# EAGLE design PCB-DISP256x64_v03-17 (EAGLE 7.7.0)

## Sheet 1 of 2
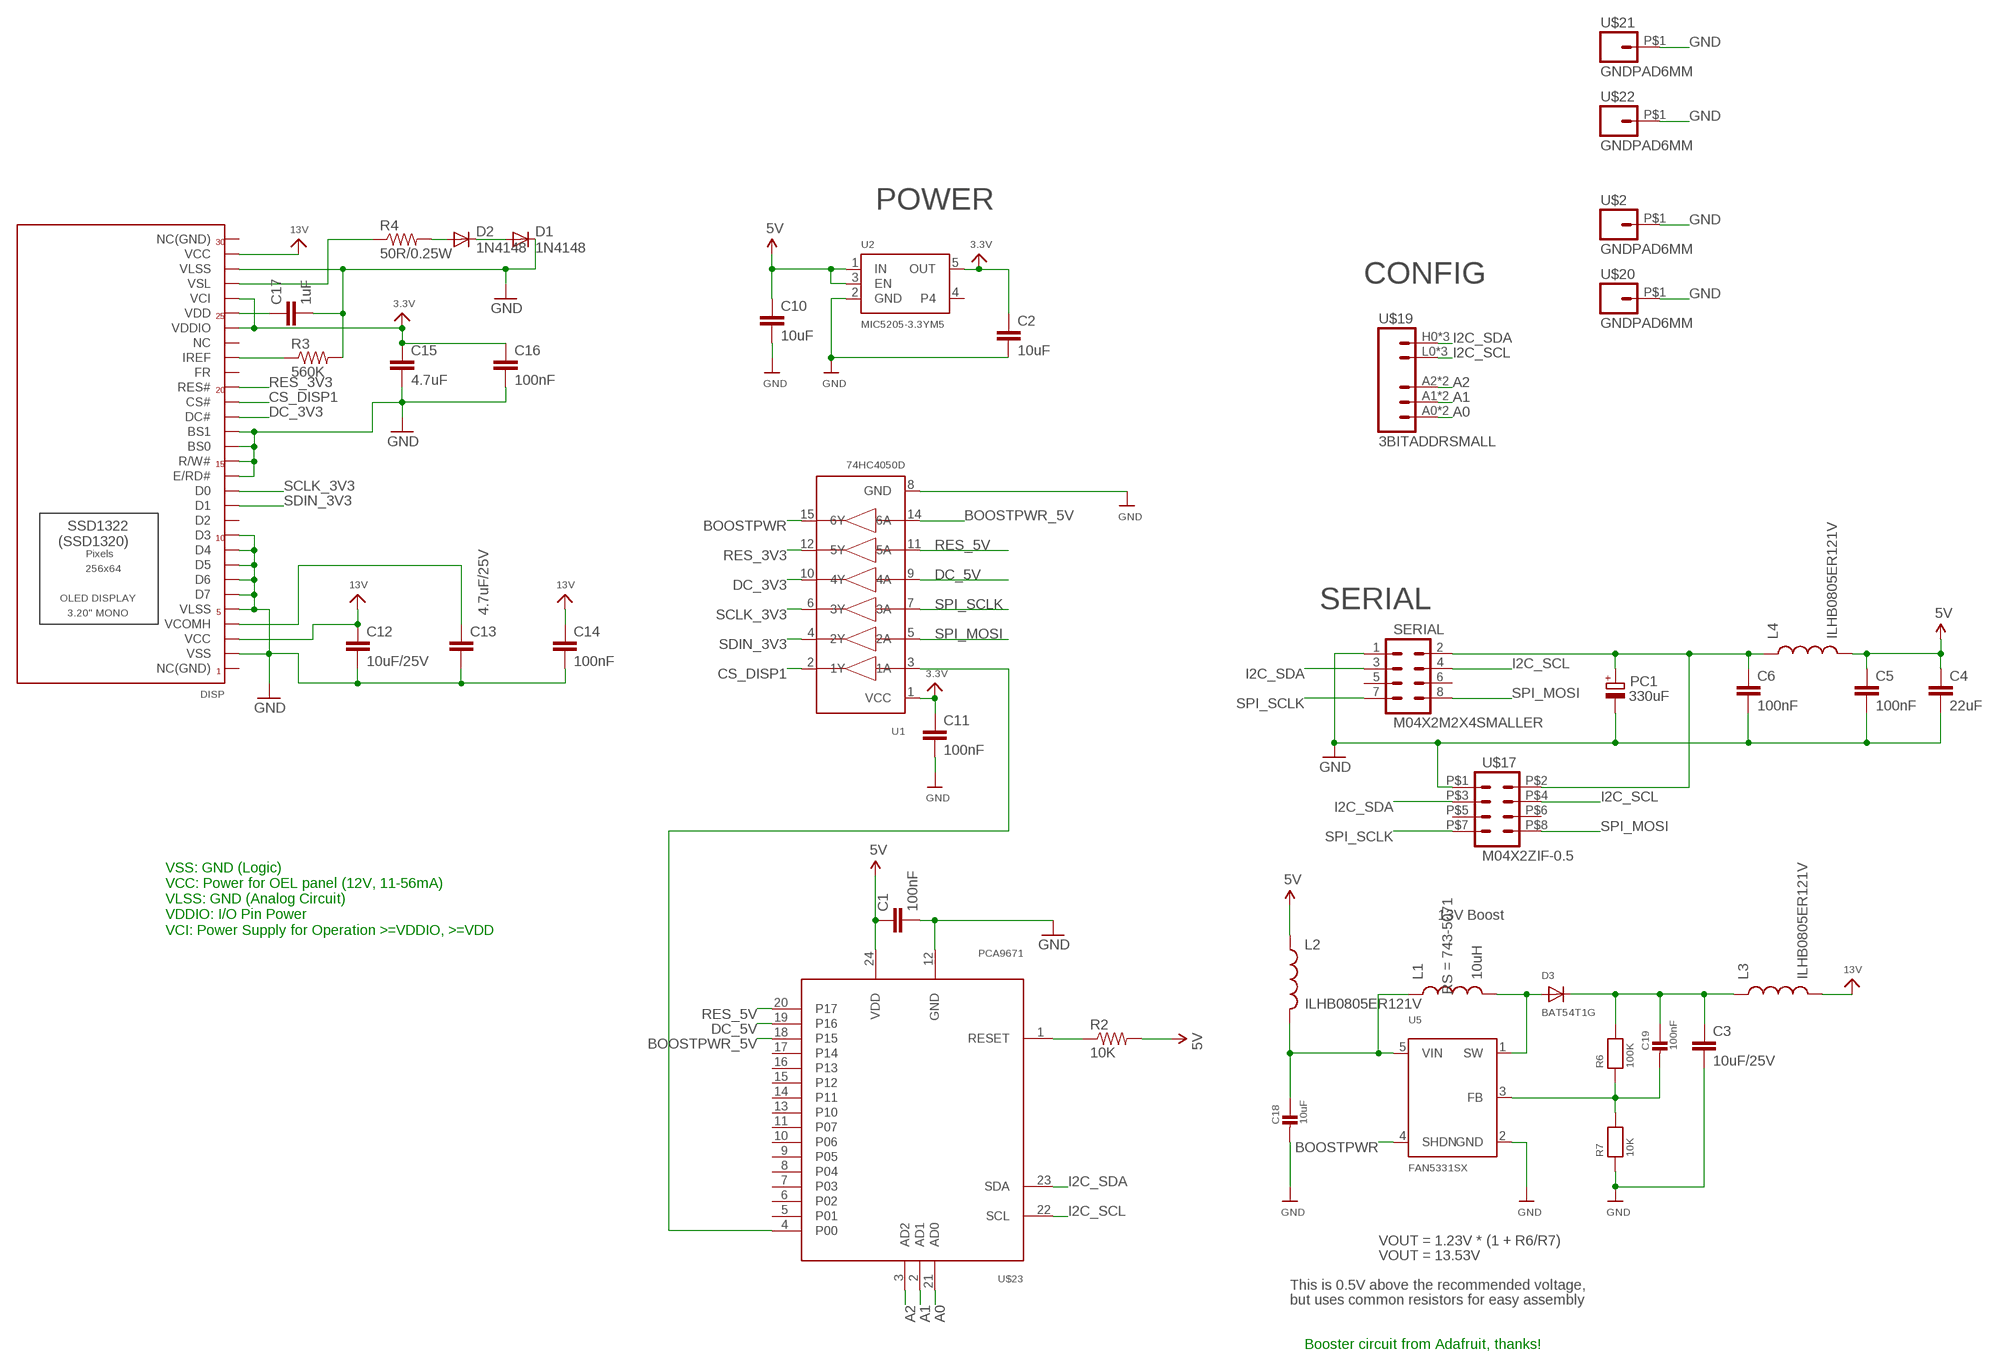
[diagram p0: schematic, sheet 1]

### Parts
C1  100nF  CAP0603-CAP  [0603-CAP]
C2  10uF  CAP0805  [0805]
C3  10uF/25V  CAP0805  [0805]
C4  22uF  CAP0805  [0805]
C5  100nF  CAP0603-CAP  [0603-CAP]
C6  100nF  CAP0603-CAP  [0603-CAP]
C10  10uF  CAP0805  [0805]
C11  100nF  CAP0603-CAP  [0603-CAP]
C12  10uF/25V  CAP0805  [0805]
C13  4.7uF/25V  CAP0805  [0805]
C14  100nF  CAP0603-CAP  [0603-CAP]
C15  4.7uF  CAP0805  [0805]
C16  100nF  CAP0603-CAP  [0603-CAP]
C17  1uF  CAP0603-CAP  [0603-CAP]
C18  10uF  CAP_CERAMIC0805  [0805]
C19  100nF  CAP_CERAMIC0603  [0603]
D1  1N4148  DIODESOD  [SOD-323]
D2  1N4148  DIODESOD  [SOD-323]
D3  BAT54T1G  DIODESOD-123  [SOD-123]
DISP  ER_OLED032-1TOP  [FPC_XF2M-3015-1A]
L1  10uH  POWERINDUCTOR  [3015]
L2  ILHB0805ER121V  INDUCTOR0805  [0805]
L3  ILHB0805ER121V  INDUCTOR0805  [0805]
L4  ILHB0805ER121V  INDUCTOR0805  [0805]
PC1  330uF  CPOL-EUD  [PANASONIC_D]
R2  10K  RESISTOR0603-RES  [0603-RES]
R3  560K  RESISTOR0603-RES  [0603-RES]
R4  50R/0.25W  RESISTOR0603-RES  [0603-RES]
R6  100K  RESISTOR0603  [0603]
R7  10K  RESISTOR0603  [0603]
SERIAL  M04X2M2X4SMALLER  [M2X4SMALLER]
U1  74HC4050D  74HC4050DTSSOP16  [TSSOP16]
U2  MIC5205-3.3YM5  VREG_SOT23-5  [SOT23-5]
U5  FAN5331SX  FAN5331  [SOT23-5@1]
U$2  GNDPAD6MM  [3.2MMPAD6MM]
U$17  M04X2ZIF-0.5  [ZIP-8-0.5]
U$19  3BITADDRSMALL  [3BITADDR_SMALL]
U$20  GNDPAD6MM  [3.2MMPAD6MM]
U$21  GNDPAD6MM  [3.2MMPAD6MM]
U$22  GNDPAD6MM  [3.2MMPAD6MM]
U$23  PCA9671  [TSSOP24]

### Nets
3.3V [Power]: C2.1 C11.1 C15.1 C16.1 DISP.P$5(VCI) DISP.P$7(VDDIO) U1.1(VCC) U2.5(OUT)
5V [Power]: C1.1 C4.1 C5.1 C10.1 L2.1 L4.2 R2.2 U2.1(IN) U2.3(EN) U$23.24(VDD)
13V [Power]: C12.1 C14.1 DISP.P$2(VCC) DISP.P$28(VCC) L3.2
A0: U$19.A0 U$19.AS0(A0) U$23.21(AD0)
A1: U$19.A1 U$19.AS1(A1) U$23.2(AD1)
A2: U$19.A2 U$19.AS2(A2) U$23.3(AD2)
ARD_5V [Power]: C6.1 L4.1 PC1.+ SERIAL.2 U$17.P$2
BOOSTPWR: U1.15(6Y) U5.4(SHDN)
BOOSTPWR_5V [Power]: U1.14(6A) U$23.18(P15)
CS_DISP1: DISP.P$12(CS#) U1.2(1Y)
DC_3V3: DISP.P$13(DC#) U1.10(4Y)
DC_5V: U1.9(4A) U$23.19(P16)
GND [Power]: C1.2 C2.2 C3.2 C4.2 C5.2 C6.2 C10.2 C11.2 C12.2 C13.2 C14.2 C15.2 C16.2 C17.2 C18.2 D1.1(C) DISP.P$3(VLSS) DISP.P$14(BS1) DISP.P$15(BS0) DISP.P$16(R/W#) DISP.P$17(E/RD#) DISP.P$21(D3) DISP.P$22(D4) DISP.P$23(D5) DISP.P$24(D6) DISP.P$25(D7) DISP.P$26(VLSS) DISP.P$29(VSS) PC1.- R3.2 R7.1 SERIAL.1 U1.8(GND) U2.2(GND) U5.2(GND) U$2.P$1 U$17.P$1 U$20.P$1 U$21.P$1 U$22.P$1 U$23.12(GND)
I2C_SCL: SERIAL.4 U$17.P$4 U$19.L0(GND) U$19.L1(GND) U$19.L2(GND) U$23.22(SCL)
I2C_SDA: SERIAL.3 U$17.P$3 U$19.H0(VCC) U$19.H1(VCC) U$19.H2(VCC) U$23.23(SDA)
N$1: R2.1 U$23.1(RESET)
N$2 [Power]: C18.1 L1.1 L2.2 U5.5(VIN)
N$3: U1.3(1A) U$23.4(P00)
N$4: C3.1 C19.1 D3.C L3.1 R6.2
N$5: C13.1 DISP.P$27(VCOMH)
N$6: DISP.P$4(VSL) R4.1
N$10: DISP.P$9(IREF) R3.1
N$11: D2.2(A) R4.2
N$12: C17.1 DISP.P$6(VDD)
N$13: D1.2(A) D2.1(C)
N$14 [BoostPower]: D3.A L1.2 U5.1(SW)
N$15: C19.2 R6.1 R7.2 U5.3(FB)
RES_3V3: DISP.P$11(RES#) U1.12(5Y)
RES_5V: U1.11(5A) U$23.20(P17)
SCLK_3V3: DISP.P$18(D0) U1.6(3Y)
SDIN_3V3: DISP.P$19(D1) U1.4(2Y)
SPI_MOSI: SERIAL.8 U1.5(2A) U$17.P$8
SPI_SCLK: SERIAL.7 U1.7(3A) U$17.P$7
Unconnected: DISP.P$1(NC(GND)) DISP.P$8(NC) DISP.P$10(FR) DISP.P$20(D2) DISP.P$30(NC(GND)) SERIAL.5 SERIAL.6 U2.4 U$17.P$5 U$17.P$6 U$23.5(P01) U$23.6(P02) U$23.7(P03) U$23.8(P04) U$23.9(P05) U$23.10(P06) U$23.11(P07) U$23.13(P10) U$23.14(P11) U$23.15(P12) U$23.16(P13) U$23.17(P14)

### Notes on the sheet
- POWER
- CONFIG
- SERIAL
- 13V Boost
- VSS: GND (Logic)
  VCC: Power for OEL panel (12V, 11-56mA)
  VLSS: GND (Analog Circuit)
  VDDIO: I/O Pin Power
  VCI: Power Supply for Operation >=VDDIO, >=VDD
- VOUT = 1.23V * (1 + R6/R7)
- VOUT = 13.53V
- This is 0.5V above the recommended voltage,
- but uses common resistors for easy assembly
- Booster circuit from Adafruit, thanks!

## Sheet 2 of 2

## Library data of the parts
C1-C6 C10-C17 = SparkFun:CAP: Capacitor Standard 0603 ceramic capacitor, and 0.1" leaded capacitor.
C18 C19 = microbuilder:CAP_CERAMIC: Ceramic Capacitors For new designs, use the packages preceded by an '_' character since they are more reliable: The following footprints should be used on most boards: _0402 - Standard footprint for regular board layouts _0603 - Standard footprint for regular board layouts _0805 - Standard footprint for regular board layouts For extremely tight-pitch boards where space is at a premium, the following 'micro-pitch' footprints can be used (smaller pads, no silkscreen outline, etc.): _0402MP - Micro-pitch footprint for very dense/compact boards _0603MP - Micro-pitch footprint for very dense/compact boards _0805MP - Micro-pitch footprint for very dense/compact boards Commonly Stocked Parts 0402 - 0402 Surface Mount Capacitors 16pF 50V 5% [Digikey: 445-4899-2-ND] 18pF 50V 5% [Digikey: 490-1281-2-ND] 22pF 50V 5% [Digikey: 490-1283-2-ND] 68pF 50V 5% [Digikey: 490-1289-2-ND] 0.1uF 10V 10% [Digikey: 490-1318-2-ND] 1.0uF 6.3V 10% [Digikey: 490-1320-2-ND] 0603 - 0603 Surface Mount Capacitors 16 pF 50V 5% [Digikey: 445-5051-2-ND] 22 pF 50V [Digikey: PCC220ACVTR-ND] 33 pF 50V 5% [Digikey: 490-1415-1-ND] 56pF 50V 5% [Digikey: 490-1421-1-ND] 220pF 50V 5% [Digikey: 445-1285-1-ND] 680 pF 50V 2200 pF 50V 5% C0G [Digikey: 445-1297-1-ND] 5600 pF 100V 5% X7R [Digikey: 478-3711-1-ND] 0.1 µF 25V 10% [Digikey: PCC2277TR-ND] 0.22 µF 16V 10% X7R [Digikey: 445-1318-1-ND] 1.0 µF 25V 10% [Digikey: 445-5146-2-ND] 0603 - RF Specific 3pF 250V +/-0.1pF RF [Digikey: 712-1347-1-ND] 18 pF 250V 5% [Digikey: 478-3505-1-ND or 712-1322-1-ND] 56 pF 250V 5% C0G RF [Digikey: 490-4867-1-ND] 68 pF 250V RF [Digikey: 490-4868-1-ND] 0805 - 0805 Surface Mount Capacitors 220 pF 250V 2% RF Ceramic Capacitor [Digikey: 712-1398-1-ND] 1000 pF 50V 2% NP0 Ceramic Capacitor [Digikey: 478-3760-1-ND] 0.1 µF 25V 10% Ceramic Capacitor [Digikey: PCC1828TR-ND] 1.0 µF 16V 10% Ceramic Capacitor[Digikey: 490-1691-2-ND] 10.0 µF 10V 10% Ceramic Capacitor[Digikey: 709-1228-1-ND] 10.0 uF 16V 10% Ceramic Capacitor [Digikey: 478-5165-2-ND] 47 uF 6.3V 20% Ceramic Capacitor [Digikey: 587-1779-1-ND or 399-5506-1-ND] 1206 - 1206 Surface Mount Capacitors 47uF 10V 20% Ceramic Capacitor [Digikey: 490-5528-1-ND or 399-5508-1-ND or 445-6010-1-ND] 100uF 6.3V -20%, +80% Y5V Ceramic Capacitor (Digikey: 490-4512-1-ND, Mouser: 81-GRM31CF50J107ZE1L)
D1 D2 = SparkFun:DIODE: Diode
D3 = microbuilder:DIODE: Diode
DISP = SKAARHOJ:ER_OLED032-1: 128x128 1.5" RGB OLED - UG-2828GDEDF11 30-Pin 0.5mm Pitch FPC Cable (Top+Bottom Contacts) - OMRON XF2M-3015-1A (Digikey: OR723TR-ND) This FPC connector has contacts on the top and bottom, but the appropriate pin needs to be selected depending on whether the OLED will be inserted right-side up (use the TOP pinout) or upside-down (use the BOTTOM pinout).
L1 = SKAARHOJ:POWERINDUCTOR; RS: 743-5071
L2-L4 = SparkFun:INDUCTOR: Inductors Basic Inductor/Choke - 0603 and 1206. Footprints are not proven and vary greatly between part numbers.
PC1 = rcl:CPOL-EU: POLARIZED CAPACITOR, European symbol
R2-R4 = SparkFun:RESISTOR: Resistor Basic schematic elements and footprints for 0603, 1206, and PTH resistors.
R6 R7 = microbuilder:RESISTOR: Resistors For new designs, use the packages preceded by an '_' character since they are more reliable: The following footprints should be used on most boards: _0402 - Standard footprint for regular board layouts _0603 - Standard footprint for regular board layouts _0805 - Standard footprint for regular board layouts For extremely tight-pitch boards where space is at a premium, the following 'micro-pitch' footprints can be used (smaller pads, no silkscreen outline, etc.): _0402MP - Micro-pitch footprint for very dense/compact boards _0603MP - Micro-pitch footprint for very dense/compact boards _0805MP - Micro-pitch footprint for very dense/compact boards
SERIAL U$17 = SKAARHOJ:M04X2
U1 = SKAARHOJ:74HC4050D: 6-channel level shifter 74HC4050D - 2V-6V Supply Digikey: 74HC4050D,653-ND Mouser: 771-74HC4050D-T
U2 = microbuilder:VREG_SOT23-5: SOT23-5 Fixed Voltage Regulators To better organise some of the SOT23-5 fixed voltage regulators in this library, this new part was created. Part Current Out V Out V In V Dropout Digikey Part No. ADP121 150mA 3.3V 3.4-5.5V 0.09V @ 150mA ADP121-AUJZ33R7CT-ND ADP121 150mA 3.0V 3.1-5.5V 0.09V @ 150mA ADP121-AUJZ30R7CT-ND ADP122 300mA 3.3V 3.4-5.5V 0.085V @ 300mA ADP122AUJZ-3.3-R7CT-ND ADP1712 300mA 3.3V 3.5-5.5V 0.17V @ 300mA ADP1712AUJZ-3.3-R7TR-ND AP7311 (Low Cost) 150mA 3.3V 3.5-6V 0.15V @ 150mA AP7311-33WG-7DICT-ND LD39015M18R 150mA 1.8V 1.9V-5.5V 0.08V @ 100mA 497-6977-1-ND MCP1824T-3302E/OT 300mA 3.3V 3.5V-6V 0.2V @ 300mA MCP1824T-3302E/OTCT-ND MIC5205-2.5YM5 TR 150mA 2.5V 2.7-16V 0.165V @ 150mA 576-1257-2-ND MIC5205-3.0YM5 TR 150mA 3.0V 3.2V-16V 0.165V @ 150mA 576-1258-2-ND MIC5205-3.3YM5 TR 150mA 3.3V 3.5V-16V 0.165V @ 150mA 576-1259-2-ND TPS780330220 150mA 3.3V+2.2V 3.6-5.5V 250mV Max 296-23332-1-ND TDA3663/N1,135 100mA 3.3V 3.5-45V 0.18V @ 50mA 568-5343-1-ND
U5 = microbuilder:FAN5331: FAN5331 - LED/OLED 20V Boost Converter Digikey: FAN5331SXCT-ND
U$2 U$20-U$22 = SKAARHOJ:GNDPAD
U$19 = SKAARHOJ:3BITADDR
U$23 = SKAARHOJ:PCA9671

## Net classes
0 default: width 0.203 mm, drill 0.406 mm, clearance 0.152 mm
1 Power: width 0.305 mm, drill 0.61 mm, clearance 0.203 mm
2 BoostPower: width 0.61 mm, drill 0.61 mm, clearance 0.305 mm

## Board
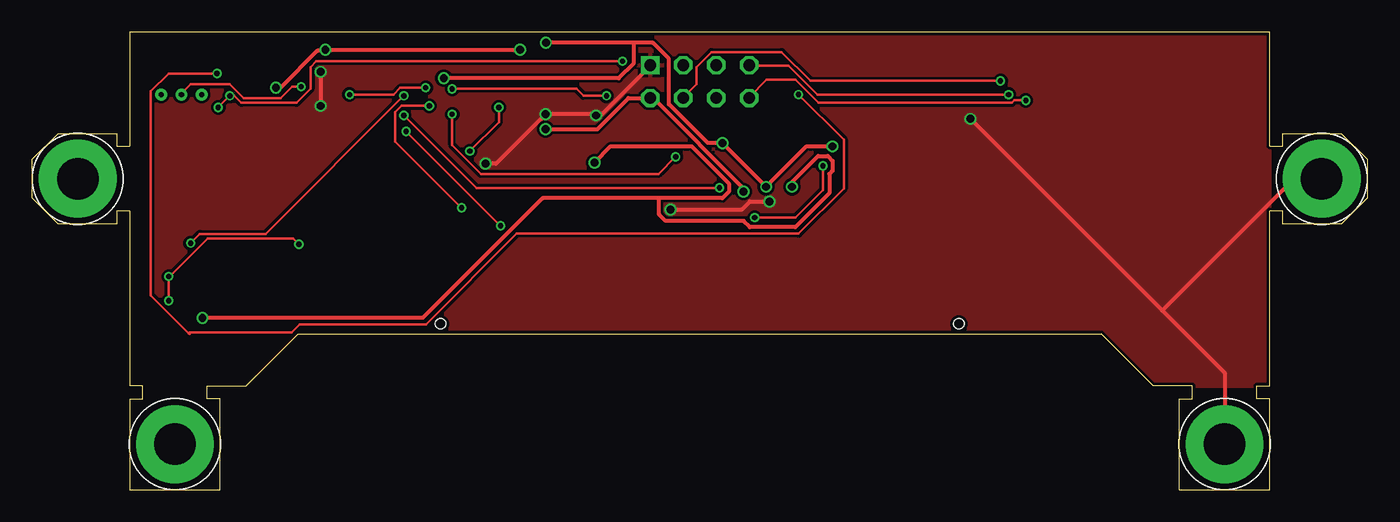
[diagram p1: board, top side]
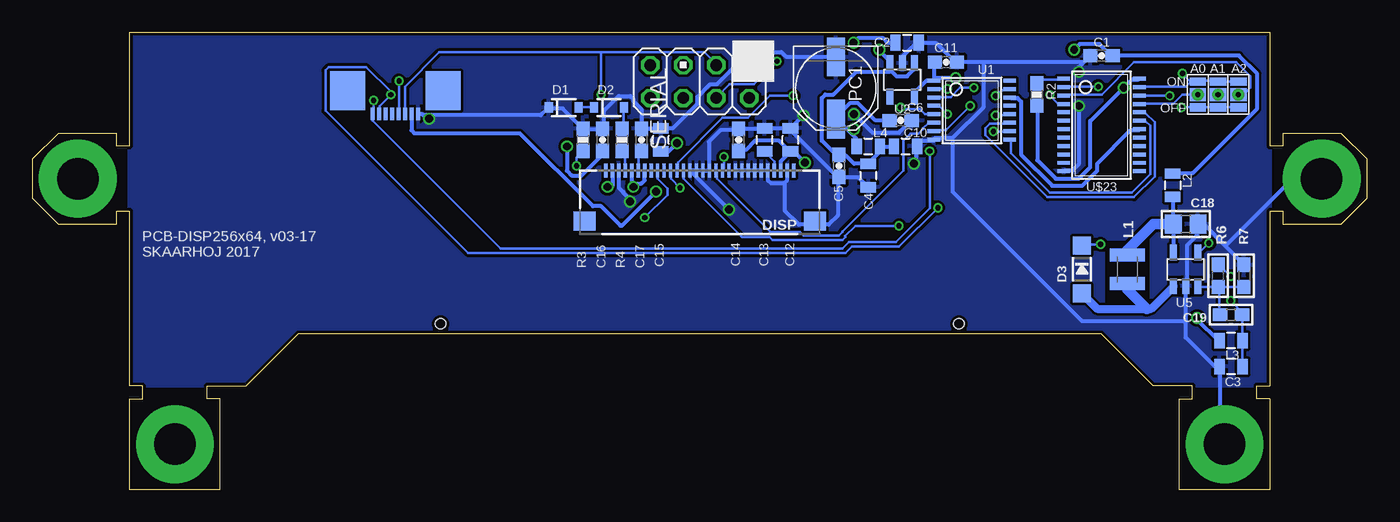
[diagram p2: board, bottom side, seen from below]

Size 103 x 35.3 mm. Coordinates in mm from the lower left corner, seen from the top.
Outline: 95.5,0 95.5,7 94.5,7 94.5,8 95.5,8 95.5,21.5 96.5,21.5 96.5,20.5 101,20.5 103,22.5 103,25.5 101,27.5 96.5,27.5 96.5,26.5 95.5,26.5 95.5,35.3 7.5,35.3 7.5,26.5 6.5,26.5 6.5,27.5 2,27.5 0,25.5 0,22.5 2,20.5 6.5,20.5 6.5,21.5 7.5,21.5 7.5,8 8.5,8 8.5,7 7.5,7 7.5,0 14.5,0 14.5,7 13.5,7 13.5,8 16.5,8 20.5,12 82.5,12 86.5,8 89.5,8 89.5,7 88.5,7 88.5,0 95.5,0
Copper layers (1*16): Top 0.035mm / dielectric 1.5mm / Bottom 0.035mm
Design rules "Fusion_eagle_rule_v1.1": minimum track width 6mil, minimum drill 12mil, track to track 6mil, track to pad 6mil, pad to pad 6mil, via to via 6mil, smd to smd 0mil, copper to edge 10mil, drill to drill 10mil, minimum pad ring 10mil, minimum via ring 6mil, stop-mask expansion 2mil, vias tented up to drill 100mil, thermal gap 10mil
Holes 0.8 mm at 31.5,12.8 71.5,12.8
tRestrict: area 17,14.5 to 20,19
bRestrict: area 17,14.5 to 20,19

### Footprints (pad centres in the part's own frame; a part is rotated, then mirrored left to right if it is on the bottom)
0603-CAP = smd 1.1 x 1: 1 -0.85,0; 2 0.85,0
0805 = smd 0.8 x 1.2: 1 -0.9,0; 2 0.9,0
0805' = smd 1.3 x 1.5: 1 -0.95,0; 2 0.95,0
0603 = smd 1.1 x 1: 1 -0.85,0; 2 0.85,0
SOD-323 = smd 0.63 x 0.83: 1 -1.15,0; 2 1.15,0
SOD-123 = smd 1.4 x 1.4: A 1.85,0; C -1.85,0
FPC_XF2M-3015-1A = smd 0.25 x 1.1: P$1 7.25,-2.63; P$2 6.75,-2.63; P$3 6.25,-2.63; P$4 5.75,-2.63; P$5 5.25,-2.63; P$6 4.75,-2.63; P$7 4.25,-2.63; P$8 3.75,-2.63; P$9 3.25,-2.63; P$10 2.75,-2.63; P$11 2.25,-2.63; P$12 1.75,-2.63; P$13 1.25,-2.63; P$14 0.75,-2.63; P$15 0.25,-2.63; P$16 -0.25,-2.63; P$17 -0.75,-2.63; P$18 -1.25,-2.63; P$19 -1.75,-2.63; P$20 -2.25,-2.63; P$21 -2.75,-2.63; P$22 -3.25,-2.63; P$23 -3.75,-2.63; P$24 -4.25,-2.63; P$25 -4.75,-2.63; P$26 -5.25,-2.63; P$27 -5.75,-2.63; P$28 -6.25,-2.63; P$29 -6.75,-2.63; P$30 -7.25,-2.63 | smd 1.7 x 1.5: SUPPORT1 8.9,1.27; SUPPORT2 -8.9,1.27
3015 = smd 1 x 2.7: 1 -1.1,0; 2 1.1,0
PANASONIC_D = smd 3 x 1.4: + 2.4,0; - -2.4,0
0603-RES = smd 1.1 x 1: 1 -0.85,0; 2 0.85,0
M2X4SMALLER = drill 0.9 square: 1 -1.27,3.81 | drill 0.9 octagon: 2 1.27,3.81; 3 -1.27,1.27; 4 1.27,1.27; 5 -1.27,-1.27; 6 1.27,-1.27; 7 -1.27,-3.81; 8 1.27,-3.81
TSSOP16 = smd 0.305 x 0.991: 1 -3.575,-2.918; 2 -2.925,-2.918; 3 -2.275,-2.918; 4 -1.625,-2.918; 5 -0.975,-2.918; 6 -0.325,-2.918; 7 0.325,-2.918; 8 0.975,-2.918; 9 0.975,2.918; 10 0.325,2.918; 11 -0.325,2.918; 12 -0.975,2.918; 13 -1.625,2.918; 14 -2.275,2.918; 15 -2.925,2.918; 16 -3.575,2.918
SOT23-5 = smd 0.55 x 1.2: 1 -0.95,-1.3; 2 0,-1.3; 3 0.95,-1.3; 4 0.95,1.3; 5 -0.95,1.3
SOT23-5@1 = smd 0.55 x 1.2: 1 -0.95,-1.3; 2 0,-1.3; 3 0.95,-1.3; 4 0.95,1.3; 5 -0.95,1.3
3.2MMPAD6MM = drill 3.2 pad 6: P$1 0,0
ZIP-8-0.5 = smd 2.7 x 3: GND$1 3.68,-1.8; GND$9 -3.68,-1.8 | smd 0.3 x 0.96: P$1 -1.75,0; P$2 -1.25,0; P$3 -0.75,0; P$4 -0.25,0; P$5 0.25,0; P$6 0.75,0; P$7 1.25,0; P$8 1.75,0
3BITADDR_SMALL = drill 0.4: A0 -1.565,0; A1 0,0; A2 1.565,0 | smd 1.27 x 1: AS0 -1.565,0; AS1 0,0; AS2 1.565,0 | smd 1.27 x 0.635: H0 -1.565,1; H1 0,1; H2 1.565,1; L0 -1.565,-1; L1 0,-1; L2 1.565,-1
TSSOP24 = smd 0.305 x 0.991: 1 -4.225,-2.918; 2 -3.575,-2.918; 3 -2.925,-2.918; 4 -2.275,-2.918; 5 -1.625,-2.918; 6 -0.975,-2.918; 7 -0.325,-2.918; 8 0.325,-2.918; 9 0.975,-2.918; 10 1.625,-2.918; 11 2.275,-2.918; 12 2.925,-2.918; 13 2.925,2.918; 14 2.275,2.918; 15 1.625,2.918; 16 0.975,2.918; 17 0.325,2.918; 18 -0.325,2.918; 19 -0.975,2.918; 20 -1.625,2.918; 21 -2.275,2.918; 22 -2.925,2.918; 23 -3.575,2.918; 24 -4.225,2.918

### Placement (x,y rotation side)
C1  20.5,33.5 180 bottom
C2  35.5,34.5 0 bottom
C3  10.5,9.5 180 bottom
C4  38.5,24.25 270 bottom
C5  40.75,24.99 270 bottom
C6  36,28.5 0 bottom
C10  35.62,26.5 0 bottom
C11  32.5,33 0 bottom
C12  44.5,27 90 bottom
C13  46.5,27 90 bottom
C14  48.5,27 90 bottom
C15  54.5,27 90 bottom
C16  59,27 90 bottom
C17  56,27 90 bottom
C18  10uF  [0805']  14,20.5 0 bottom
C19  10.5,13.5 180 bottom
D1  62,29.5 0 bottom
D2  58.5,29.5 0 bottom
D3  22,17 270 bottom
DISP  51.5,22 180 bottom
L1  18.5,17 270 bottom
L2  15,23.5 270 bottom
L3  10.5,11.5 180 bottom
L4  38.5,26.5 0 bottom
PC1  41,31 270 bottom
R2  25.5,30.5 270 bottom
R3  60.5,27 90 bottom
R4  57.5,27 90 bottom
R6  11.5,16.5 90 bottom
R7  9.5,16.5 270 bottom
SERIAL  51.5,31.5 270 bottom
U1  30.5,28 270 bottom
U2  35.87,31.64 180 bottom
U5  14,17 0 bottom
U$2  11,3.5 0 top
U$17  75,29 180 bottom
U$19  11.5,30.5 0 bottom
U$20  92,3.5 0 top
U$21  3.5,24 0 top
U$22  99.5,24 0 top
U$23  20.5,27.5 270 bottom

### Tracks (layer width: path | path; a pad name or v marks a point on that pad's centre or on a via)
3.3V  (via drill 0.61)
  Top 0.305: v61.75,26.5 59.75,26.5 v56.62,23.38 v53.25,26.75 52.12,26.75 49.12,29.75 49.12,33.25 47.88,34.5 46.38,34.5 | 46.38,34.5 v39.62,34.5 | v31.75,31.75 45.25,31.75 46.38,32.88 46.38,34.5
  Bottom 0.305: U2.5 34.88,30.4 34.88,30.67 33.99,31.56 33.55,31.56 U1.1 33.38,31.62 33.38,31.75 | 33.38,31.75 33.38,33 C11.1 | DISP.P$7 55.75,23.88 56,23.62 56.5,23.62 | 56.5,23.62 56.75,23.88 DISP.P$5 | C16.1 59,25.88 60.62,24.25 61.38,24.25 61.75,24.62 v61.75,26.5 | v56.62,23.38 56.5,23.5 56.5,23.62 | v53.25,26.75 53.88,26.12 54.5,26.12 C15.1 | C2.1 37,34.5 37.38,34.88 39.25,34.88 v39.62,34.5 | v31.75,31.75 33.38,31.75
5V  (via drill 0.61)
  Top 0.305: v37.64,33.96 v22.61,33.96 22.52,33.87 21.99,33.87 19.15,31.03 v18.79,31.03
  Bottom 0.305: U$23.24 17.63,31.65 18.17,31.65 v18.79,31.03 21.37,28.45 21.37,24.89 22.26,24 24.04,24 25.46,25.43 25.46,29.6 R2.2 | 36.75,32.36 36.3,31.91 35.5,31.91 34.97,32.45 34.97,32.89 U2.1 | 36.75,32.36 36.75,32.89 U2.3 36.84,33.07 37.64,33.87 v37.64,33.96 | C10.1 36.57,26.49 37.55,26.49 L4.2 37.64,26.4 37.64,26.05 38.44,25.25 C4.1 38.53,25.16 39.59,25.16 40.22,25.78 40.75,25.78 C5.1 40.84,25.96 41.1,25.96 42.08,26.94 42.08,30.23 41.81,30.49 41.19,30.49 39.41,32.27 36.84,32.27 36.75,32.36 | L2.1 14.97,24.45 13.46,24.45 8.48,29.43 8.48,32.09 9.9,33.52 19.59,33.52 C1.1 19.77,33.52 20.66,34.4 22.17,34.4 v22.61,33.96
13V  (via drill 0.61)
  Top 0.305: v13.12,13.25 30.12,13.25 39.38,22.5 48.38,22.5 | 48.38,22.5 53.25,22.5 53.75,23 53.75,23.62 50.88,26.5 44.62,26.5 v43.38,25.25 | 48.38,22.5 48.38,21.25 48.88,20.75 54.88,20.75 55.38,20.25 58.88,20.25 61.5,22.88 61.5,24.38 61.75,24.62 61.75,25.38 61.38,25.75 60.62,25.75 58.62,23.75 v58.62,23.38
  Bottom 0.305: C14.1 48.48,26.23 47.95,26.23 47.24,26.94 45.37,26.94 44.57,26.14 C12.1 | DISP.P$28 45.25,25.35 C12.1 | v13.12,13.25 13.12,13.12 11.5,11.5 L3.2 | v43.38,25.25 44.25,26.12 44.38,26.12 C12.1 | DISP.P$2 58.25,23.42 58.4,23.27 | 58.4,23.27 58.43,23.24 | v58.62,23.38 58.5,23.38 58.4,23.27
A0
  Bottom 0.203: U$23.21 17.55,29.78 14.97,29.78 14.26,30.49 13.1,30.49 U$19.AS0
A1  (via drill 0.41)
  Top 0.203: v20.75,31.11 20.04,31.11 19.15,30.23 16.3,30.23 15.23,31.29 12.21,31.29 11.5,30.58 U$19.AS1
  Bottom 0.203: v20.75,31.11 23.41,31.11 U$23.2 | U$19.AS1
A2
  Bottom 0.203: U$23.3 23.41,30.49 20.48,30.49 17.99,32.98 10.08,32.98 9.01,31.91 9.01,31.03 9.46,30.58 9.9,30.58 U$19.AS2 9.99,30.49
ARD_5V  (via drill 0.61)
  Top 0.305: v39.59,27.83 43.59,27.83 45.99,30.23 SERIAL.2 47.75,30.12 48,30.12 54.88,23.25 v54.88,23
  Bottom 0.305: C6.1 36.93,28.54 37.99,28.54 39.33,29.87 39.86,29.87 40.93,28.8 40.93,28.63 PC1.+ 40.84,28.54 39.86,27.56 | 39.86,27.56 39.41,27.11 39.41,26.58 L4.1 | 39.86,27.56 v39.59,27.83 | U$17.P$2 73.75,27.75 73.5,27.5 65.38,27.5 59.75,21.88 59.12,21.88 57.62,20.38 57.5,20.38 v54.88,23
BOOSTPWR  (via drill 0.41)
  Top 0.203: v28.66,30.4 17.99,19.74 12.92,19.74 v12.21,19.02
  Bottom 0.203: v28.66,30.4 28.21,30.85 27.59,30.85 U1.15 | v12.21,19.02 13.01,18.22 U5.4
BOOSTPWR_5V
  Bottom 0.305: U$23.18 17.63,27.74 18.26,27.74 20.84,25.16 20.84,24.62 21.99,23.47 24.3,23.47 26.7,25.87 26.7,29.96 26.97,30.23 27.5,30.23 U1.14
CS_DISP1  (via drill 0.41)
  Top 0.203: v32.39,30.94 41.99,30.94 42.53,30.4 v44.3,30.4
  Bottom 0.203: v32.39,30.94 33.37,30.94 U1.2 | v44.3,30.4 46.08,30.4 47.77,28.71 49.73,28.71 53.2,25.25 53.2,24.71 DISP.P$12
DC_3V3  (via drill 0.41)
  Top 0.203: v36.13,20.36 v28.84,27.65
  Bottom 0.203: v28.84,27.65 27.59,27.65 U1.10 | v36.13,20.36 39.5,20.36 40.3,19.56 40.25,19.5 40.5,19.25 45.88,19.25 46.12,19.5 48.25,19.5 48.3,19.56 52.75,24 DISP.P$13
DC_5V
  Bottom 0.203: U1.9 27.5,26.94 27.5,25.96 24.48,22.94 18.17,22.94 16.75,24.36 16.75,28.09 17.1,28.45 17.55,28.45 U$23.19
GND  (via drill 0.61)
  Top 0.305: 43.51,28.98 43.95,28.98 47.68,32.72 SERIAL.1 | 43.51,28.98 v39.59,28.98 35.77,25.16 v34.97,25.16 | v43.51,28.89 43.51,28.98 | v22.25,32.25 v22.25,29.62 | U$20.P$1 92,9 87.19,13.81 | v72.38,28.62 87.19,13.81 | v56.88,22.25 55.38,22.25 54.75,21.62 v49.25,21.62 | 87.19,13.81 97.38,24 U$22.P$1
  Bottom 0.305: U2.2 35.86,32.98 35.86,33.43 34.7,34.58 C2.2 34.53,34.49 33.28,34.49 31.86,33.07 31.68,33.07 C11.2 29.62,33 | 10.94,18.82 12.57,20.45 13.01,20.45 C18.2 13.12,20.38 13.12,19.62 13.88,18.88 13.88,15.75 U5.2 13.99,15.56 13.99,13 | 10.94,18.82 9.54,17.42 R7.1 | U$2.P$1 11.32,3.82 11.32,8.98 C3.2 11.41,9.16 13.99,11.73 13.99,13 | 45.02,23.65 44.75,23.91 DISP.P$29 | 45.02,23.65 45.99,23.65 46.26,23.91 DISP.P$26 46.35,24.62 46.7,24.62 DISP.P$25 46.88,24.62 47.24,24.62 DISP.P$24 47.33,24.62 47.68,24.62 DISP.P$23 47.86,24.62 48.22,24.62 DISP.P$22 48.39,24.62 DISP.P$21 | C5.2 40.75,24.09 39.24,24.09 38.53,23.38 C4.2 | 52.12,24.62 51.86,24.62 DISP.P$15 51.68,24.62 51.33,24.62 DISP.P$16 51.24,24.62 50.79,24.62 DISP.P$17 50.79,24.71 50.79,26.85 49.91,27.74 48.57,27.74 C14.2 48.48,27.83 46.53,27.83 C13.2 46.35,27.91 44.57,27.91 C12.2 | 52.12,24.62 52.22,24.62 DISP.P$14 | C5.2 40.84,24.27 41.02,24.27 44.57,27.83 C12.2 | 45.02,23.65 44.93,23.56 44.93,21.51 43.86,20.45 41.55,20.45 40.84,21.16 40.84,24 C5.2 | v39.59,28.98 38.17,27.56 36.13,27.56 35.24,28.45 C6.2 | PC1.- 41.02,33.43 44.84,33.43 45.19,33.78 46.7,33.78 47.68,32.8 SERIAL.1 47.77,32.72 48.75,32.72 50.17,31.29 50.7,31.29 51.68,30.32 51.68,29.78 53.55,27.91 54.35,27.91 C15.2 54.53,27.83 55.95,27.83 C17.2 56,29.38 56.62,30 56.62,30.12 56.88,30.38 57.75,30.38 58.88,29.25 58.88,27.88 C16.2 59.06,27.83 60.4,27.83 R3.2 60.57,27.91 62.09,29.43 63.06,29.43 D1.1 63.24,29.43 63.77,28.89 72.38,28.89 | 72.38,28.89 72.84,28.89 72.93,28.98 73.2,28.98 U$17.P$1 | v43.51,28.89 44.39,28 C12.2
  Bottom 0.305: v34.97,25.16 34.79,25.34 34.79,26.4 C10.2 34.7,26.58 34.35,26.94 33.46,26.94 U1.8 33.38,27.12 32,27.12 | v22.25,29.62 22.25,25.12 22.75,24.62 23.38,24.62 U$23.12 | v22.25,32.25 22.25,32.62 21.94,32.94 | 21.94,32.94 21.38,33.5 C1.2 | 29.62,33 22,33 21.94,32.94 | 32,27.12 29.62,29.5 29.62,33 | 13.99,13 22,13 32,23 32,27.12 | v72.38,28.62 72.38,28.89 | DISP.P$3 57.75,23.33 57.41,22.99 57.38,22.88 56.88,22.38 v56.88,22.25 | v49.25,21.62 52.12,24.5 52.12,24.62 | U$21.P$1 5.75,24 10.94,18.82
  pour Top: 7.5,8 95.5,8 95.5,35.5 7.5,35.5
  pour Bottom: 7.5,8 95.5,8 95.5,35.5 7.5,35.5
I2C_SCL  (via drill 0.41)
  Top 0.203: v14.34,29.52 v15.23,30.4 15.59,30.4 16.12,29.87 20.39,29.87 21.46,30.94 21.46,32.63 21.9,33.07 v45.55,33.07 | v74.71,31.56 60.04,31.56 57.82,33.78 52.4,33.78 51.24,32.63 51.24,31.29 50.26,30.32 SERIAL.4
  Bottom 0.203: U$19.L2 9.99,29.52 11.41,29.52 U$19.L1 11.59,29.52 13.01,29.52 U$19.L0 13.1,29.52 v14.34,29.52 | v15.23,30.4 17.55,30.4 U$23.22 | v74.71,31.56 74.71,29.07 U$17.P$4 | v45.55,33.07 47.33,31.29 49.19,31.29 50.17,30.32 SERIAL.4
I2C_SDA  (via drill 0.41)
  Top 0.203: v14.25,32.12 10.5,32.12 9.12,30.75 9.12,15 12.06,12.06 | 12.12,12 12.06,12.06 | v59.12,30.5 62.62,27 62.62,23.25 59.12,19.75 37.38,19.75 30.38,12.75 20.62,12.75 20,12.12 12.12,12.12 12.06,12.06
  Bottom 0.203: U$23.23 17.55,31.11 13.99,31.11 13.63,31.47 13.1,31.47 U$19.H0 | U$19.H0 13.01,31.56 11.59,31.56 U$19.H1 U$19.H2 | U$17.P$3 74.25,31.12 71.62,33.75 59.12,33.75 | 59.12,33.75 51.12,33.75 50.25,32.88 SERIAL.3 | v14.25,32.12 13.62,31.5 U$19.H0 | 59.12,33.75 v59.12,30.5
N$1
  Bottom 0.203: U$23.1 23.5,31.65 25.19,31.65 25.46,31.38 R2.1
N$2
  Bottom 0.305: U5.5 14.97,18.31 14.97,20.45 C18.1 14.97,20.62 14.97,22.58 L2.2
  Bottom 0.813: L1.1 18.5,18.5 16.5,20.5 C18.1
N$3  (via drill 0.41)
  Top 0.203: v24.48,30.49 27.86,30.49 28.39,31.03 v30.35,31.03
  Bottom 0.203: v24.48,30.49 24.48,30.4 23.86,29.78 23.5,29.78 U$23.4 | v30.35,31.03 31.41,31.03 32.12,30.32 33.37,30.32 U1.3
N$4  (via drill 0.41)
  Top 0.203: v10.52,14.58 v10.52,16.45 10.61,16.45 13.54,19.38 20.12,19.38 v20.57,18.94
  Bottom 0.203: v10.52,16.45 11.41,17.34 R6.2 | v10.52,14.58 9.63,13.69 9.63,13.6 C19.1 9.63,13.42 9.63,11.56 L3.1 9.63,11.47 9.63,9.07 C3.1 | v20.57,18.94 21.99,18.94 D3.C
N$5
  Bottom 0.203: DISP.P$27 45.73,24.71 45.73,25.34 46.44,26.05 C13.1
N$6
  Bottom 0.203: DISP.P$4 57.28,24.71 57.28,25.96 57.46,26.14 R4.1
N$10  (via drill 0.41)
  Top 0.203: v55.75,21 58.88,21 61,23.12 v61,25
  Bottom 0.203: DISP.P$9 54.75,24 54,23.25 54,22.75 v55.75,21 | v61,25 61,25.62 60.5,26.12 R3.1
N$11
  Bottom 0.203: D2.2 57.37,29.43 57.37,28 57.46,27.91 R4.2
N$12
  Bottom 0.203: DISP.P$6 56.22,24.71 56.22,25.96 56.04,26.14 C17.1
N$13
  Bottom 0.203: D2.1 59.68,29.52 60.84,29.52 D1.2
N$14
  Bottom 0.61: U5.1 14.97,15.65 16.66,13.96 17,13.96 20.84,13.96 21.99,15.11 D3.A
  Bottom 0.813: L1.2 18.5,15.46 17,13.96
N$15
  Bottom 0.203: C19.2 11.41,13.51 11.41,15.65 R6.1 | R7.2 9.54,15.65 11.32,15.65 R6.1 | U5.3 13.01,15.65 11.59,15.65 R6.1
RES_3V3  (via drill 0.41)
  Top 0.203: v28.66,28.89 34.26,23.29 v53.02,23.29
  Bottom 0.203: v28.66,28.89 27.59,28.89 U1.12 | v53.02,23.29 53.73,24 53.73,24.62 DISP.P$11
RES_5V
  Bottom 0.203: U1.11 27.59,28.27 29.1,28.27 29.46,27.91 29.46,27.38 24.66,22.58 17.99,22.58 16.39,24.18 16.39,28.36 17.1,29.07 17.55,29.07 U$23.20
SCLK_3V3
  Bottom 0.203: U1.6 33.46,28.27 33.9,28.27 34.26,27.91 34.26,27.83 34.61,27.47 35.24,27.47 35.77,26.94 35.77,24.62 40.48,19.91 40.5,19.88 40.75,19.62 43.5,19.62 43.75,19.88 46,19.88 46.08,19.91 50.17,24 50.17,24.62 DISP.P$18
SDIN_3V3  (via drill 0.41)
  Top 0.203: v32.39,28.98 32.39,26.58 34.61,24.36 48.3,24.36 v49.64,25.69
  Bottom 0.203: v32.39,28.98 33.01,29.6 33.37,29.6 U1.4 | v49.64,25.69 49.64,24.8 49.73,24.71 DISP.P$19
SPI_MOSI  (via drill 0.41)
  Top 0.203: v76.66,30.05 75.78,30.05 75.6,29.87 60.66,29.87 58.88,31.65 56.66,31.65 55.33,30.32 SERIAL.8 | v36,29.5 36,28.38 v33.75,26.12
  Bottom 0.203: v76.66,30.05 76.66,29.07 U$17.P$8 76.75,28.5 66.88,18.62 40.5,18.62 40,19.12 36.38,19.12 33.75,21.75 v33.75,26.12 | v36,29.5 35.88,29.38 34.5,29.38 34.12,29 33.5,29 U1.5
SPI_SCLK  (via drill 0.41)
  Top 0.203: v75.33,30.49 60.57,30.49 58.35,32.72 55.33,32.72 SERIAL.7 | v30.62,29.62 28.5,29.62 28,29.12 28,26.88 v33.12,21.75
  Bottom 0.203: U$17.P$7 76.22,29.07 76.22,29.6 v75.33,30.49 75.38,30.5 75.38,30.75 77.25,32.62 80.12,32.62 80.38,32.38 80.38,29.25 69.38,18.25 40.25,18.25 39.75,18.75 36.12,18.75 v33.12,21.75 | v30.62,29.62 32.5,27.75 33.38,27.75 U1.7

### Text on the board
_bsilk: PCB-DISP256x64, v03-17 / SKAARHOJ 2017